# Altium schematic sheet QCopterMV_FFC_Sch.SchDoc: QCopterMV-FFCSPI
size 127 x 101 mm; Author: Hom; CompanyName: KitSprout; DrawnBy: Hom; Engineer: Hom; Organization: KitSprout; Revision: A; SheetNumber: 1; SheetTotal: 1; License: CC BY-SA 4.0; Version: 2.0; LibVersion: 2.7; PageSetup: Record=PageOptions|CenterHorizontal=True|CenterVertical=True|PrintScale=1.00|XCorrection=1.00|YCorrection=1.00|PrintKind=0|BorderSize=5000000|LeftOffset=0|BottomOffset=0|Orientation=2|PaperLength=1000|PaperWidth=1000|Scale=100|PaperSource=7|PrintQuality=-4|MediaType=1|DitherType=10|PaperKind=A4|PrintScaleMode=0
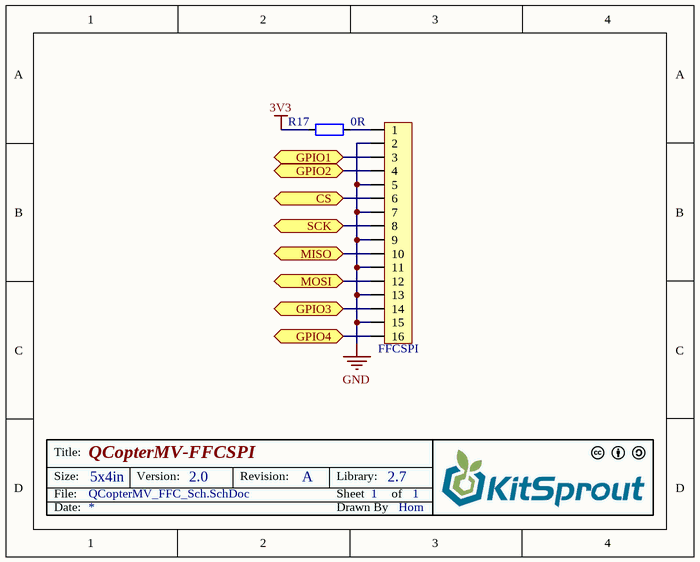
[diagram p0: QCopterMV_FFC_Sch.SchDoc]

## Parts
FFCSPI  FFC_0.5_16  [FFC_0.5_16]  (value not drawn)
R17  value 0R  [RES_0603]  (hidden comment: Res_0603)

## Ports
CS, GPIO1, GPIO2, GPIO3, GPIO4, MISO, MOSI, SCK

## Nets
3V3: R17.1
GND: FFCSPI.2 FFCSPI.5 FFCSPI.7 FFCSPI.9 FFCSPI.11 FFCSPI.13 FFCSPI.15
CS: FFCSPI.6 ; port CS
GPIO1: FFCSPI.3 ; port GPIO1
GPIO2: FFCSPI.4 ; port GPIO2
GPIO3: FFCSPI.14 ; port GPIO3
GPIO4: FFCSPI.16 ; port GPIO4
MISO: FFCSPI.10 ; port MISO
MOSI: FFCSPI.12 ; port MOSI
SCK: FFCSPI.8 ; port SCK
NetFFCSPI_1: FFCSPI.1 R17.2

## Notes on the sheet
- Title:
- Size:
- Date:
- File:
- 5x4in
- Version:
- Revision:
- Sheet
- Drawn By
- Library:
- of

## Library data of the parts
FFCSPI = FFC_0.5_16: FFC
R17 = Res_0603: Resistor